# Altium schematic sheet Buck.SchDoc: 24-12V BUCK
size 279 x 215 mm; CheckedBy: KYLE HONG; Engineer: SAHIL KALE; Revision: 1.0; SheetNumber: 2; SheetTotal: 4
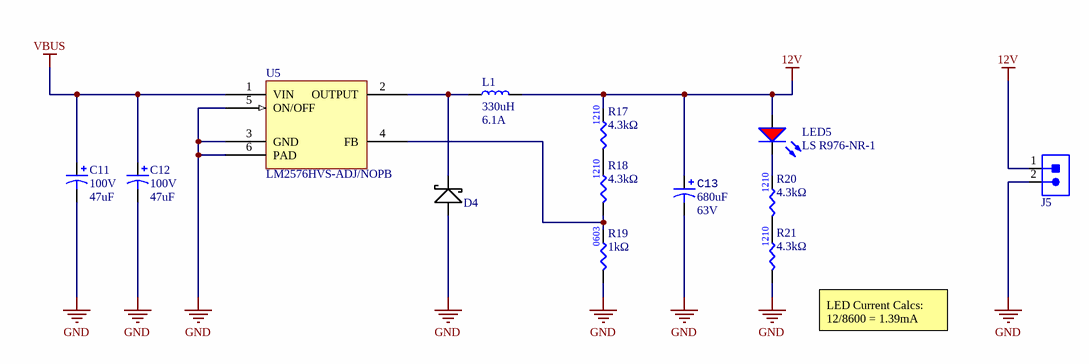
[diagram p0: Buck.SchDoc]

## Parts
C11  Voltage Rating: 100V  Capacitance: 47uF  [RADIAL_CORNELL_D]  (hidden comment: CAP_47uF_100V_ALUM)
C12  Voltage Rating: 100V  Capacitance: 47uF  [RADIAL_CORNELL_D]  (hidden comment: CAP_47uF_100V_ALUM)
C13  value 680uF  Voltage Rating: 63V  [ELXZ630ELL681MM20S]  (hidden comment: CAP_680uF_63V_ALUM)
D4  DIO_SCHOTTKY_20V_3A  [SS32]  (value not drawn)
J5  CON_2POS_SCREW_TERM  [1935161]  (value not drawn)
L1  Current Rating: 6.1A  Inductance: 330uH  [74437529203331]  (hidden comment: IND_330uH_6.1A)
LED5  Manufacturer Part Number 1: LS R976-NR-1  [LED_0805_RED]  (hidden comment: LED_RED)
R17  value 4.3kΩ  [RES1210]  (hidden comment: RES_4.3kΩ_1210_5%)
R18  value 4.3kΩ  [RES1210]  (hidden comment: RES_4.3kΩ_1210_5%)
R19  value 1kΩ  [RES0603]  (hidden comment: RES_1kΩ_0603_5%)
R20  value 4.3kΩ  [RES1210]  (hidden comment: RES_4.3kΩ_1210_5%)
R21  value 4.3kΩ  [RES1210]  (hidden comment: RES_4.3kΩ_1210_5%)
U5  Manufacturer Part Number: LM2576HVS-ADJ/NOPB  [D2PAK-5]  (hidden comment: BUCK_ADJ_4_57_V)

## Nets
12V: C13.1 J5.1 L1.2 LED5.1(A) R17.2
GND: C11.2 C12.2 C13.2 D4.2(A) J5.2 R19.1 R21.1 U5.3(GND) U5.5(ON/OFF) U5.6(PAD)
VBUS: C11.1 C12.1 U5.1(VIN)
NetD4_1: D4.1(K) L1.1 U5.2(OUTPUT)
NetLED5_2: LED5.2(K) R20.2
NetR17_1: R17.1 R18.2
NetR18_1: R18.1 R19.2 U5.4(FB)
NetR20_1: R20.1 R21.2

## Notes on the sheet
- (near R21) LED Current Calcs:
  12/8600 = 1.39mA
- University of Waterloo Robotics Team
- 200 University Ave W
- REV
- PROJECT
- Waterloo, Ontario, Canada
- N2L 3G1
- DOCUMENT
- ENGINEER
- REVIEWER
- MODIFIED
- SHEET
- OF

## Library data of the parts
C11 C12 = CAP_47uF_100V_ALUM: Aluminum Electrolytic Capacitor, Polarized, Aluminum (wet), 100V, 20% +Tol, 20% -Tol, 47uF, Surface Mount, 5454; Manufacturer: Nichicon; Manufacturer Part Number: UCD2A470MNQ1MS; Dielectric Material: Aluminium; Leakage Current: 47uA; Ripple Current: 250mA; Tan Delta: 0.07; ComponentLink1URL: https://datasheet.ciiva.com:443/pdfs/VipMasterIC/IC/NICH/NICH-S-A0003527725/NICH-S-A0003527725-1.pdf?src-supplier=IHS+Markit; ComponentLink1Description: https://datasheet.ciiva.com:443/pdfs/VipMasterIC/IC/NICH/NICH-S-A0003527725/NICH-S-A0003527725-1.pdf?src-supplier=IHS+Markit; ComponentLink2URL: https://datasheet.ciiva.com/11776/0900766b80ebdadd-11776792.pdf?src-supplier=RSComponents; ComponentLink2Description: https://datasheet.ciiva.com/11776/0900766b80ebdadd-11776792.pdf?src-supplier=RSComponents; ComponentLink3URL: https://datasheet.ciiva.com/30526/getdatasheetpartid-513218-30526979.pdf?src-supplier=Verical; ComponentLink3Description: https://datasheet.ciiva.com/30526/getdatasheetpartid-513218-30526979.pdf?src-supplier=Verical; ComponentLink4URL: https://datasheet.ciiva.com/16389/e-cd-16389182.pdf?src-supplier=Future+Electronics; ComponentLink4Description: https://datasheet.ciiva.com/16389/e-cd-16389182.pdf?src-supplier=Future+Electronics; ComponentLink5URL: https://datasheet.ciiva.com/17523/e-cd-17523974.pdf?src-supplier=Avnet+Europe; ComponentLink5Description: https://datasheet.ciiva.com/17523/e-cd-17523974.pdf?src-supplier=Avnet+Europe; ComponentLink6URL: https://datasheet.ciiva.com/6326/e-cd-6326630.pdf?src-supplier=Digi-Key; ComponentLink6Description: https://datasheet.ciiva.com/6326/e-cd-6326630.pdf?src-supplier=Digi-Key; ComponentLink7URL: https://datasheet.ciiva.com/6326/e-cd-6326632.pdf?src-supplier=Digi-Key; ComponentLink7Description: https://datasheet.ciiva.com/6326/e-cd-6326632.pdf?src-supplier=Digi-Key; ComponentLink8URL: https://datasheet.ciiva.com/6326/e-cd-6326634.pdf?src-supplier=Digi-Key; ComponentLink8Description: https://datasheet.ciiva.com/6326/e-cd-6326634.pdf?src-supplier=Digi-Key; Supplier 1: Digi-Key; RoHS: Yes; Category: Aluminum Electrolytic Capacitors; Stock 1: 515; Pricing 1: 1=2.15000, 10=1.69800, 50=1.47140, 100=1.27330 (USD); Mount: Surface Mount; Number of Pins: 2; Package Shape: Cylindrical; Size Code: 7575; Terminal Finish: Copper; Min Operating Temperature: -55°C; Max Operating Temperature: 105°C; JESD-609 Code: e3; Polarity: Polarized; Capacitor Type: Aluminium; Negative Tolerance: 20%; Package Style: SMTMeter; Packaging: Tape and Reel; Positive Tolerance: 20%; Rated DC Voltage (URdc): 100V; Termination: Flat; Length: 14.6mm; Width: 13.6mm; Height: 13.5mm; REACH SVHC: Yes; RoHS Compliant: Yes; Supplier Part Number 1: 493-6201-1-ND
C13 = CAP_680uF_63V_ALUM: CAP ALUM 680UF 20% 63V RADIAL; Manufacturer 1: United Chemi-Con; Supplier 1: Digi-Key; Manufacturer Part Number 1: ELXZ630ELL681MM20S; Voltage: 63V; Supplier Part Number 1: 565-2050-ND; Mounting Type: SMD
D4 = DIO_SCHOTTKY_20V_3A: DIODE SCHOTTKY 20V 3A SMC; Manufacturer 1: ON Semiconductor / Fairchild; Part number: SS32; Supplier Part Number 1: SS32CT-ND; Supplier 1: Digi-Key; Manufacturer Part Number 1: SS32
J5 = CON_2POS_SCREW_TERM: TERM BLK 2POS SIDE ENTRY 5MM; Manufacturer 1: Phoenix Contact; Package/Footprint: SMD; Supplier 1: Digi-Key; Mounting Type: TH; Supplier Part Number 1: 277-1667-ND; Manufacturer Part Number 1: 1935161
L1 = IND_330uH_6.1A: General Purpose Inductor; Manufacturer: Wurth Electronics; Supplier 1: Digi-Key; Manufacturer Part Number: 74437529203331; RoHS: Yes; Category: Fixed Inductors; Stock 1: 443; Pricing 1: 1=8.85000, 50=7.76200, 100=6.93000, 270=6.30000 (USD); Inductor Type: GENERAL PURPOSE INDUCTOR; REACH SVHC: Yes; RoHS Compliant: Yes; ComponentLink1URL: https://datasheet.ciiva.com:443/pdfs/VipMasterIC/IC/MIDC/MIDC-S-A0004023785/MIDC-S-A0004024368-1.pdf?src-supplier=IHS+Markit; ComponentLink1Description: https://datasheet.ciiva.com:443/pdfs/VipMasterIC/IC/MIDC/MIDC-S-A0004023785/MIDC-S-A0004024368-1.pdf?src-supplier=IHS+Markit; ComponentLink2URL: https://katalog.we-online.de/pbs/datasheet/74437529203331.pdf?src-supplier=Digi-Key; ComponentLink2Description: https://katalog.we-online.de/pbs/datasheet/74437529203331.pdf?src-supplier=Digi-Key; Supplier Part Number 1: 732-11718-ND
LED5 = LED_RED: LED RED DIFFUSED 0805 SMD; Manufacturer 1: OSRAM; Package/Footprint: 0805; Forward Voltage Drop: 2V; Supplier Part Number 1: 475-1278-1-ND; Supplier 1: Digi-Key; Mounting Type: SMD
R17 R18 R20 R21 = RES_4.3kΩ_1210_5%: RES 4.3K OHM 5% 1/2W 1210; Manufacturer 1: Panasonic; Manufacturer Part Number 1: ERJ-14YJ432U; Supplier 1: Digi-Key; Mounting Type: SMD; Tolerance: 5%; Supplier Part Number 1: P4.3KVCT-ND; Package: 1210
R19 = RES_1kΩ_0603_5%: RES 1K OHM 5% 1/10W 0603; Manufacturer 1: Yageo; Manufacturer Part Number 1: RC0603JR-071KL; Supplier Part Number 1: 311-1.0KGRCT-ND; Supplier 1: Digi-Key; Mounting Type: SMD; Package: 0603
U5 = BUCK_ADJ_4_57_V: Switching Regulator, Voltage-mode, 7.5A, 63kHz Switching Freq-Max, BIPolar, PSSO5; Manufacturer: TI National Semiconductor; Package Body Material: Plastic; Control Technique: PULSE WIDTH MODULATION; Max Input Voltage: 60V; Min Input Voltage: 8V; Nominal Input Voltage: 12V; Number of Functions: 1; Package Equivalence Code: SMSIP5H,.6,67TB; Switcher Configuration: BUCK; Time @ Peak Reflow Temperature-Max (s): 30s; Qualification Status: Not Qualified; Supplier 1: Digi-Key; RoHS: Yes; Category: Power Supply Modules; Stock 1: 1907; Pricing 1: 1=9.24000, 10=8.34300, 25=7.95520, 100=6.90760, 250=6.59712, 500=6.40676 (USD); Package Code: TO-263; Number of Pins: 5; Package Shape: Rectangular; Terminal Finish: Tin; Min Operating Temperature: -40°C; Max Operating Temperature: 125°C; JESD-609 Code: e3; Analog IC - Other Type: SWITCHING REGULATOR; Control Mode: VOLTAGE-MODE; JESD-30 Code: R-PSSO-G5; Moisture Sensitivity Level: 3; Max Output Current: 7.5A; Package Style: SMALL OUTLINEMeter; Peak Reflow Temperature (Cel): 245°C; Surface Mount: Yes; Switching Frequency-Max: 63kHz; Technology: BIPOLAR; Terminal Form: Gull Wing; Terminal Position: SINGLE; Length: 10.16mm; Width: 8.635mm; Height - Seated (Max): 4.8mm; Terminal Pitch: 1.7mm; Temperature Grade: AUTOMOTIVE; REACH SVHC: No SVHC; RoHS Compliant: Yes; ComponentLink1URL: https://datasheet.ciiva.com:443/pdfs/VipMasterIC/IC/NATL/NATLE100002/NATLS13855-1.pdf?src-supplier=IHS+Markit; ComponentLink1Description: https://datasheet.ciiva.com:443/pdfs/VipMasterIC/IC/NATL/NATLE100002/NATLS13855-1.pdf?src-supplier=IHS+Markit; ComponentLink2URL: https://datasheet.ciiva.com/27055/1992558-27055825.pdf?src-supplier=Jameco; ComponentLink2Description: https://datasheet.ciiva.com/27055/1992558-27055825.pdf?src-supplier=Jameco; ComponentLink3URL: https://datasheet.ciiva.com/14150/dznatsemico-schaltr-lm2576-en-14150697.pdf?src-supplier=Distrelec; ComponentLink3Description: https://datasheet.ciiva.com/14150/dznatsemico-schaltr-lm2576-en-14150697.pdf?src-supplier=Distrelec; ComponentLink4URL: https://datasheet.ciiva.com/15112/getdatasheetpartid-55583-15112655.pdf?src-supplier=Verical; ComponentLink4Description: https://datasheet.ciiva.com/15112/getdatasheetpartid-55583-15112655.pdf?src-supplier=Verical; ComponentLink5URL: https://datasheet.ciiva.com/16466/lm2576-16466300.pdf?src-supplier=Avnet+Asia; ComponentLink5Description: https://datasheet.ciiva.com/16466/lm2576-16466300.pdf?src-supplier=Avnet+Asia; ComponentLink6URL: https://datasheet.ciiva.com/6596/lm2576hv-6596079.pdf?src-supplier=Digi-Key; ComponentLink6Description: https://datasheet.ciiva.com/6596/lm2576hv-6596079.pdf?src-supplier=Digi-Key; ComponentLink7URL: https://datasheet.ciiva.com/22669/1849802-22669437.pdf?src-supplier=Element14; ComponentLink7Description: https://datasheet.ciiva.com/22669/1849802-22669437.pdf?src-supplier=Element14; Supplier Part Number 1: LM2576HVS-ADJ/NOPB-ND